# Altium schematic sheet LED matrix.SchDoc: Megabit LED Matrix
size A4; DocumentNumber: 1; Revision: 1; SheetNumber: 2; SheetTotal: 2
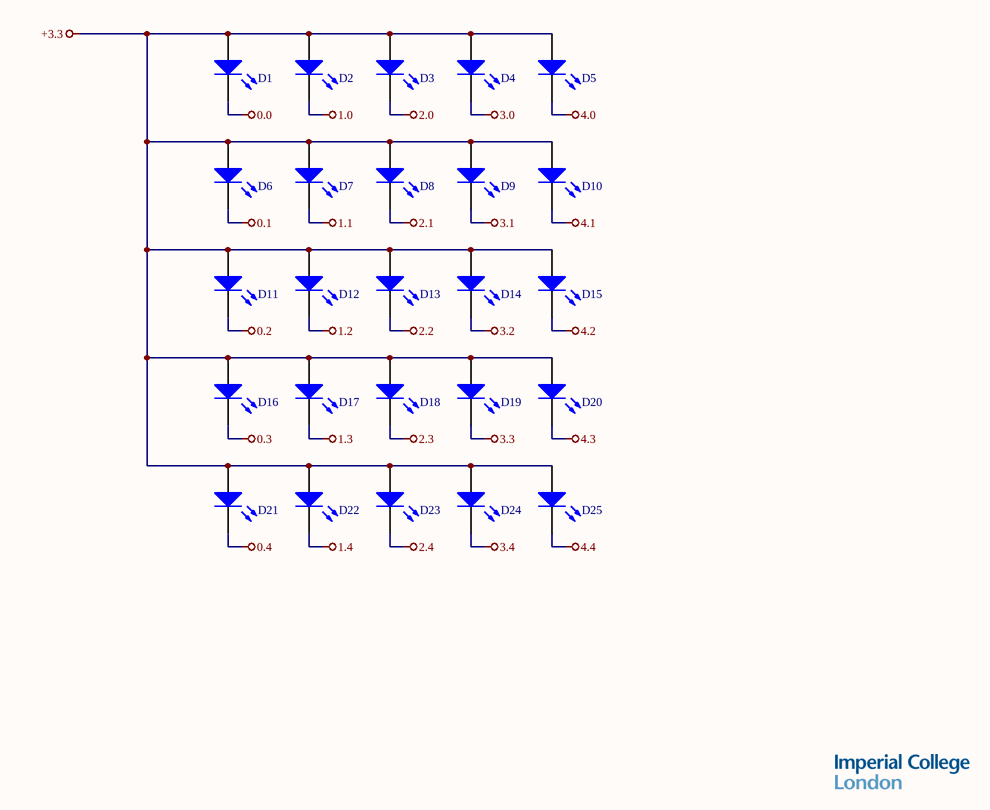
[diagram p0: LED matrix.SchDoc]

## Parts
D1  LED  [PCBComponent_1 - duplicate]  (value not drawn)
D2  LED  [PCBComponent_1 - duplicate]  (value not drawn)
D3  LED  [PCBComponent_1 - duplicate]  (value not drawn)
D4  LED  [PCBComponent_1 - duplicate]  (value not drawn)
D5  LED  [PCBComponent_1 - duplicate]  (value not drawn)
D6  LED  [PCBComponent_1 - duplicate]  (value not drawn)
D7  LED  [PCBComponent_1 - duplicate]  (value not drawn)
D8  LED  [PCBComponent_1 - duplicate]  (value not drawn)
D9  LED  [PCBComponent_1 - duplicate]  (value not drawn)
D10  LED  [PCBComponent_1 - duplicate]  (value not drawn)
D11  LED  [PCBComponent_1 - duplicate]  (value not drawn)
D12  LED  [PCBComponent_1 - duplicate]  (value not drawn)
D13  LED  [PCBComponent_1 - duplicate]  (value not drawn)
D14  LED  [PCBComponent_1 - duplicate]  (value not drawn)
D15  LED  [PCBComponent_1 - duplicate]  (value not drawn)
D16  LED  [PCBComponent_1 - duplicate]  (value not drawn)
D17  LED  [PCBComponent_1 - duplicate]  (value not drawn)
D18  LED  [PCBComponent_1 - duplicate]  (value not drawn)
D19  LED  [PCBComponent_1 - duplicate]  (value not drawn)
D20  LED  [PCBComponent_1 - duplicate]  (value not drawn)
D21  LED  [PCBComponent_1 - duplicate]  (value not drawn)
D22  LED  [PCBComponent_1 - duplicate]  (value not drawn)
D23  LED  [PCBComponent_1 - duplicate]  (value not drawn)
D24  LED  [PCBComponent_1 - duplicate]  (value not drawn)
D25  LED  [PCBComponent_1 - duplicate]  (value not drawn)

## Nets
0.0: D1.2(K)
0.1: D6.2(K)
0.2: D11.2(K)
0.3: D16.2(K)
0.4: D21.2(K)
1.0: D2.2(K)
1.1: D7.2(K)
1.2: D12.2(K)
1.3: D17.2(K)
1.4: D22.2(K)
2.0: D3.2(K)
2.1: D8.2(K)
2.2: D13.2(K)
2.3: D18.2(K)
2.4: D23.2(K)
3.0: D4.2(K)
3.1: D9.2(K)
3.2: D14.2(K)
3.3: D19.2(K)
3.4: D24.2(K)
4.0: D5.2(K)
4.1: D10.2(K)
4.2: D15.2(K)
4.3: D20.2(K)
4.4: D25.2(K)
+3.3: D1.1(A) D2.1(A) D3.1(A) D4.1(A) D5.1(A) D6.1(A) D7.1(A) D8.1(A) D9.1(A) D10.1(A) D11.1(A) D12.1(A) D13.1(A) D14.1(A) D15.1(A) D16.1(A) D17.1(A) D18.1(A) D19.1(A) D20.1(A) D21.1(A) D22.1(A) D23.1(A) D24.1(A) D25.1(A)

## Notes on the sheet
- Title
- Size:
- Date:
- A4
- Number:
- Time:
- Revision:
- Sheet
- of
- File:

## Library data of the parts
D1-D25 = CMP-c7440e1cac271883-4: L-793SRD-E, Round Series Red LED, 640 nm 8 mm, Round Lens Through Hole package; Mounting Style: Through Hole, PCB